# EAGLE design Sensor_LinearCCD_Socket (EAGLE 9.2.1)
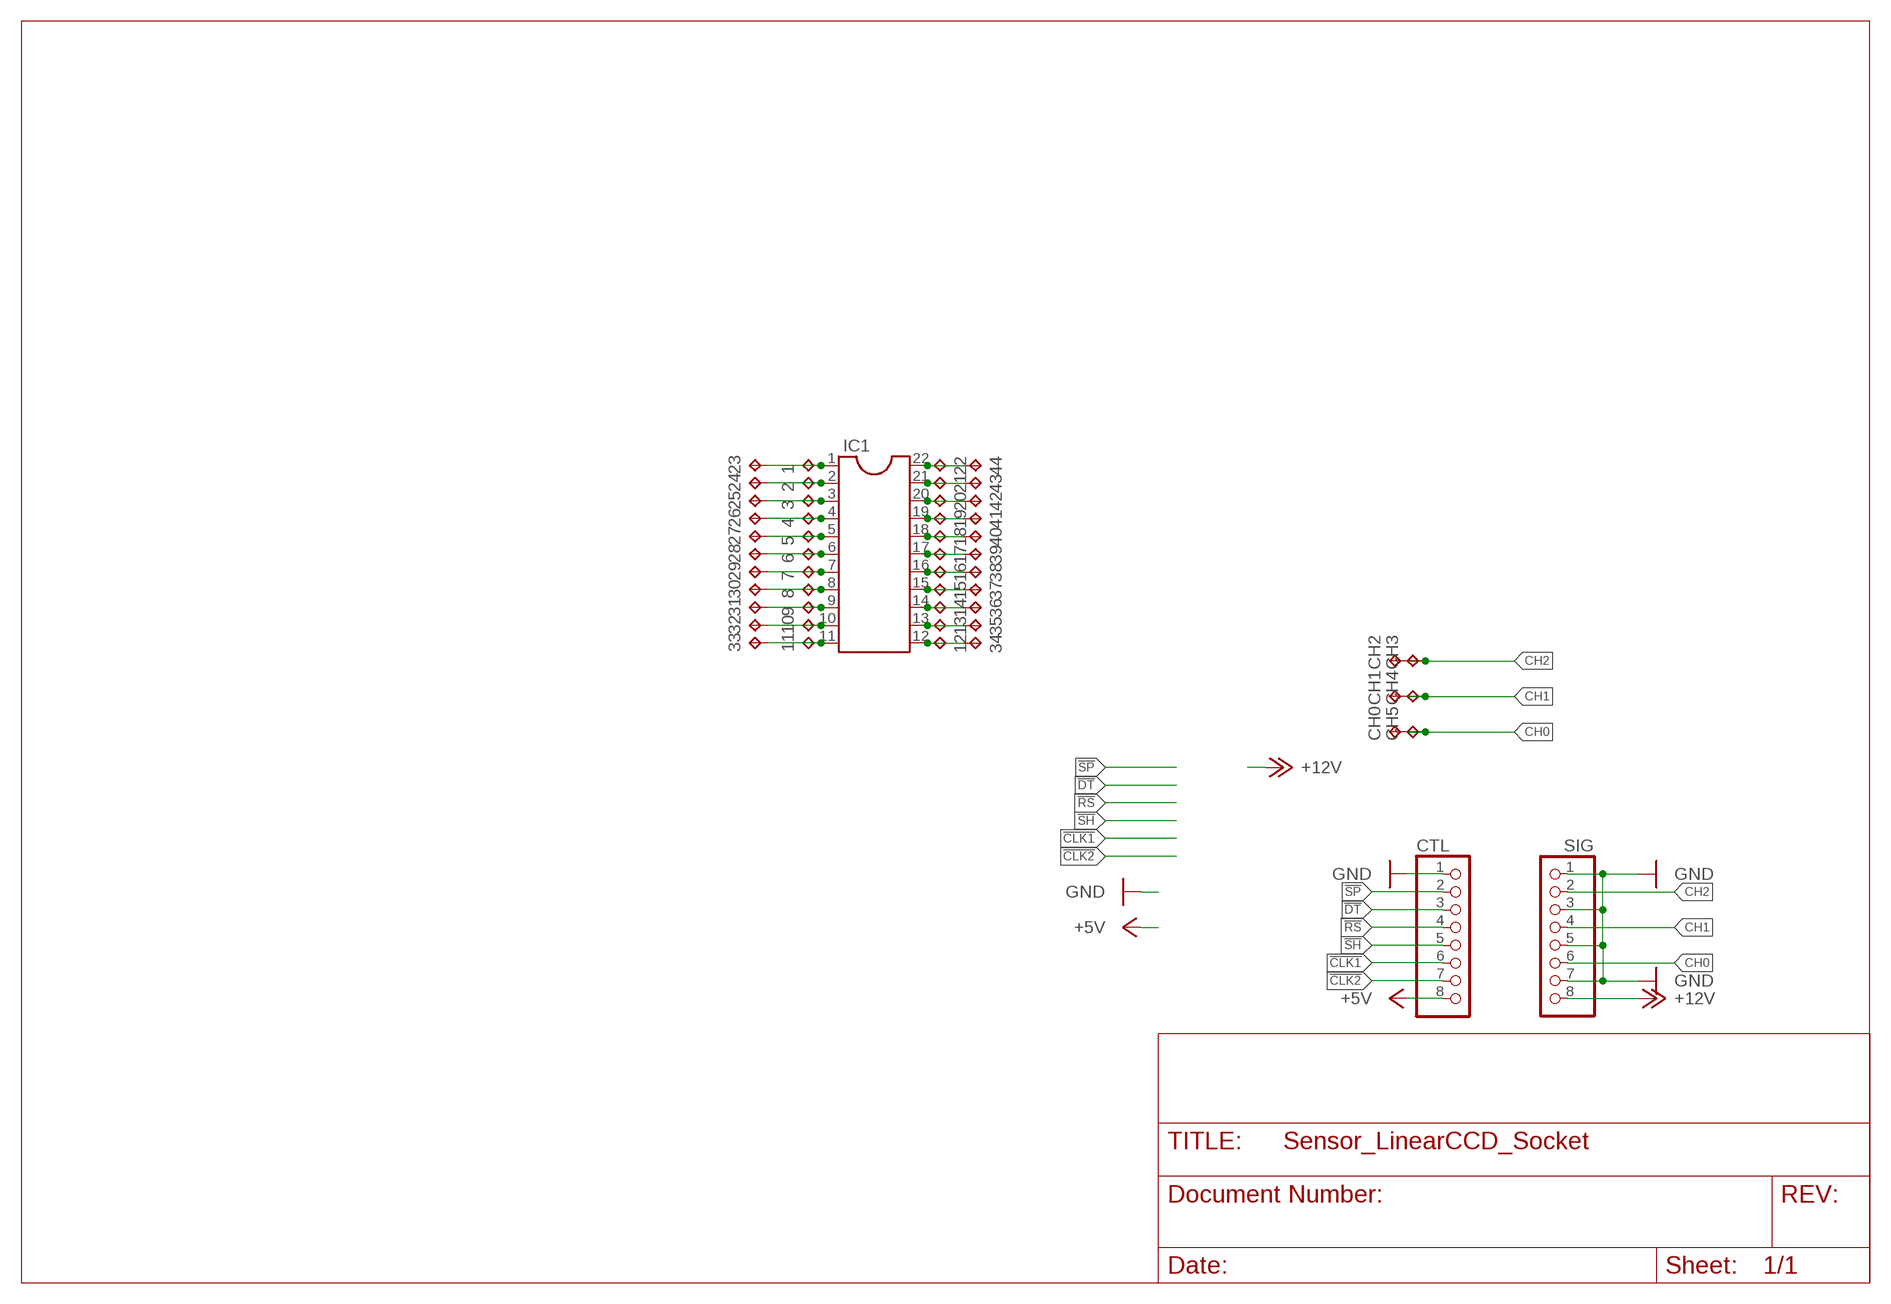
[diagram p0: schematic, sheet 1]

## Parts
1  TPTP15SQ  [TP15SQ]
2  TPTP15SQ  [TP15SQ]
3  TPTP15SQ  [TP15SQ]
4  TPTP15SQ  [TP15SQ]
5  TPTP15SQ  [TP15SQ]
6  TPTP15SQ  [TP15SQ]
7  TPTP15SQ  [TP15SQ]
8  TPTP15SQ  [TP15SQ]
9  TPTP15SQ  [TP15SQ]
10  TPTP15SQ  [TP15SQ]
11  TPTP15SQ  [TP15SQ]
12  TPTP15SQ  [TP15SQ]
13  TPTP15SQ  [TP15SQ]
14  TPTP15SQ  [TP15SQ]
15  TPTP15SQ  [TP15SQ]
16  TPTP15SQ  [TP15SQ]
17  TPTP15SQ  [TP15SQ]
18  TPTP15SQ  [TP15SQ]
19  TPTP15SQ  [TP15SQ]
20  TPTP15SQ  [TP15SQ]
21  TPTP15SQ  [TP15SQ]
22  TPTP15SQ  [TP15SQ]
23  TPTP15SQ  [TP15SQ]
24  TPTP15SQ  [TP15SQ]
25  TPTP15SQ  [TP15SQ]
26  TPTP15SQ  [TP15SQ]
27  TPTP15SQ  [TP15SQ]
28  TPTP15SQ  [TP15SQ]
29  TPTP15SQ  [TP15SQ]
30  TPTP15SQ  [TP15SQ]
31  TPTP15SQ  [TP15SQ]
32  TPTP15SQ  [TP15SQ]
33  TPTP15SQ  [TP15SQ]
34  TPTP15SQ  [TP15SQ]
35  TPTP15SQ  [TP15SQ]
36  TPTP15SQ  [TP15SQ]
37  TPTP15SQ  [TP15SQ]
38  TPTP15SQ  [TP15SQ]
39  TPTP15SQ  [TP15SQ]
40  TPTP15SQ  [TP15SQ]
41  TPTP15SQ  [TP15SQ]
42  TPTP15SQ  [TP15SQ]
43  TPTP15SQ  [TP15SQ]
44  TPTP15SQ  [TP15SQ]
CH0  TPTP15SQ  [TP15SQ]
CH1  TPTP15SQ  [TP15SQ]
CH2  TPTP15SQ  [TP15SQ]
CH3  TPTP15SQ  [TP15SQ]
CH4  TPTP15SQ  [TP15SQ]
CH5  TPTP15SQ  [TP15SQ]
CTL  PINHD-1X8_2.00  [1X08M]
IC1  DIL22-4  [DIL22-4]
SIG  PINHD-1X8_2.00  [1X08M]

## Nets
!CLK1!: CTL.6
!CLK2!: CTL.7
!DT!: CTL.3
!RS!: CTL.4
!SH!: CTL.5
!SP!: CTL.2
+5V: CTL.8
+12V: SIG.8
CH0: CH0.TP CH5.TP SIG.6
CH1: CH1.TP CH4.TP SIG.4
CH2: CH2.TP CH3.TP SIG.2
GND: CTL.1 SIG.1 SIG.3 SIG.5 SIG.7
N$1: 1.TP 23.TP IC1.1
N$2: 2.TP 24.TP IC1.2
N$3: 3.TP 25.TP IC1.3
N$4: 4.TP 26.TP IC1.4
N$5: 5.TP 27.TP IC1.5
N$6: 6.TP 28.TP IC1.6
N$7: 7.TP 29.TP IC1.7
N$8: 8.TP 30.TP IC1.8
N$9: 9.TP 31.TP IC1.9
N$10: 10.TP 32.TP IC1.10
N$11: 11.TP 33.TP IC1.11
N$12: 12.TP 34.TP IC1.12
N$13: 13.TP 35.TP IC1.13
N$14: 14.TP 36.TP IC1.14
N$15: 15.TP 37.TP IC1.15
N$16: 16.TP 38.TP IC1.16
N$17: 17.TP 39.TP IC1.17
N$18: 18.TP 40.TP IC1.18
N$19: 19.TP 41.TP IC1.19
N$20: 20.TP 42.TP IC1.20
N$21: 21.TP 43.TP IC1.21
N$22: 22.TP 44.TP IC1.22

## Library data of the parts
1-44 CH0 CH1-CH5 = testpad:TP: Test pad
CTL SIG = pinhead-1:PINHD-1X8: PIN HEADER
IC1 = ic-package:DIL22: Dual In Line / Socket

## Board
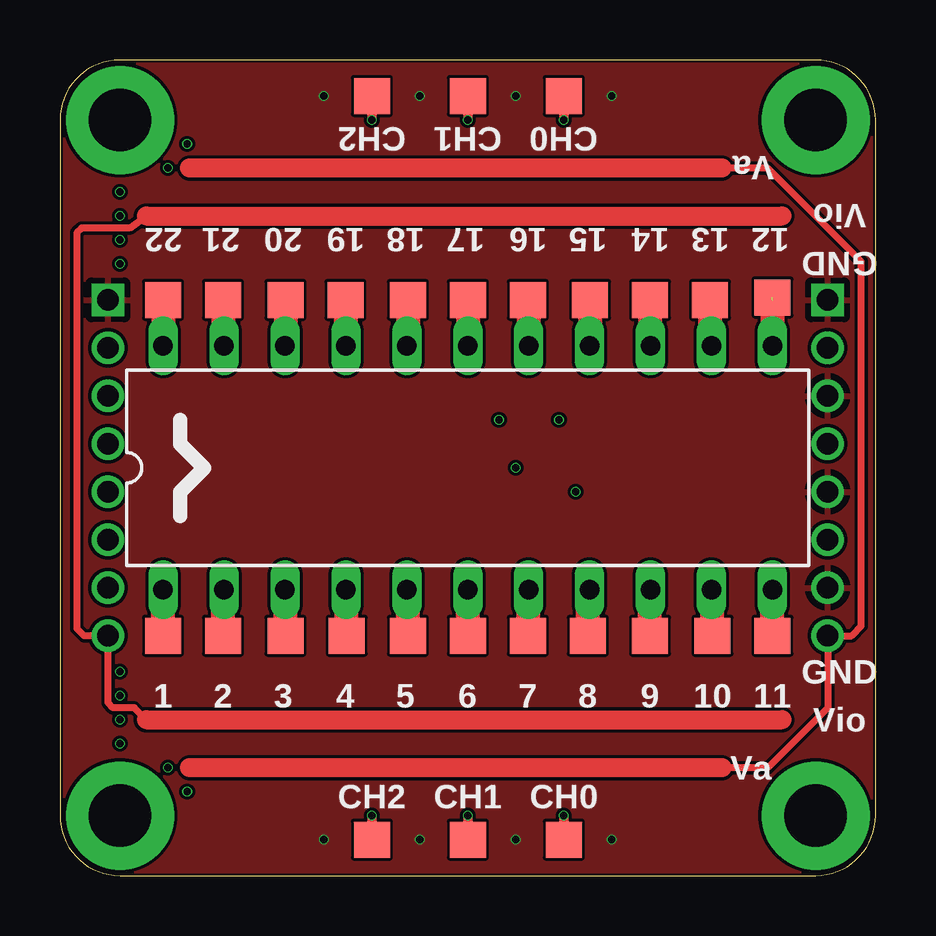
[diagram p1: board, top side]
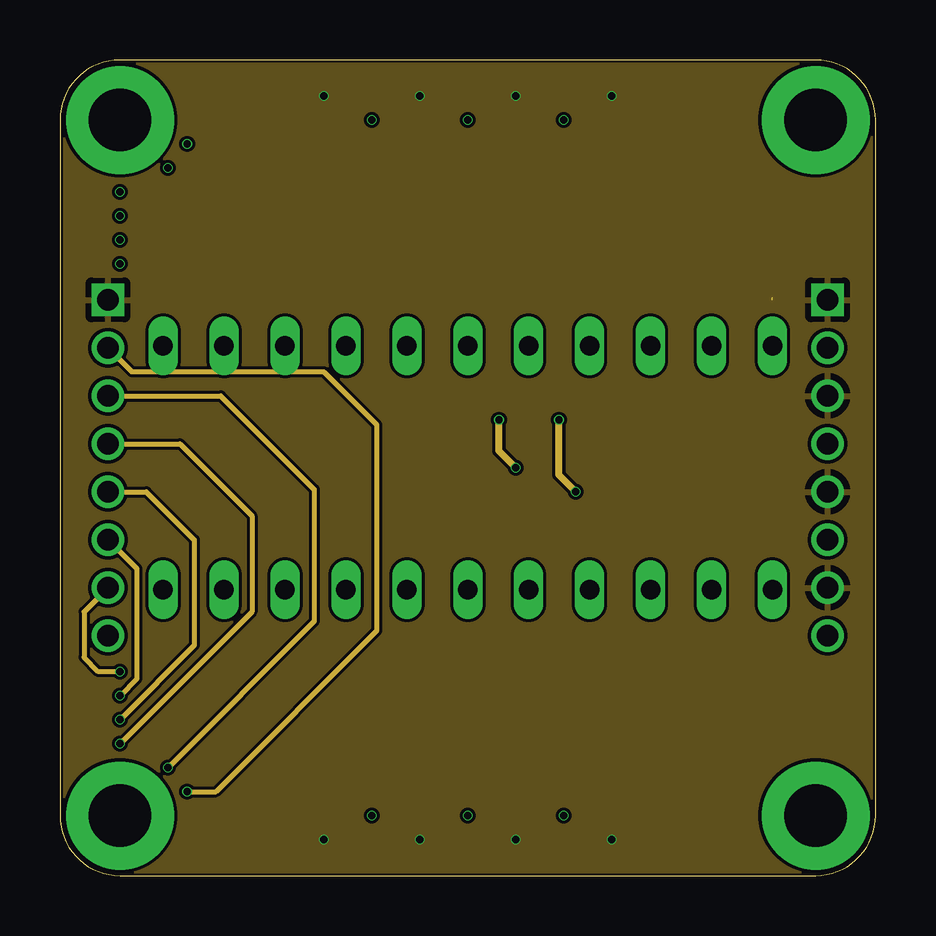
[diagram p2: board, inner layer Route2]
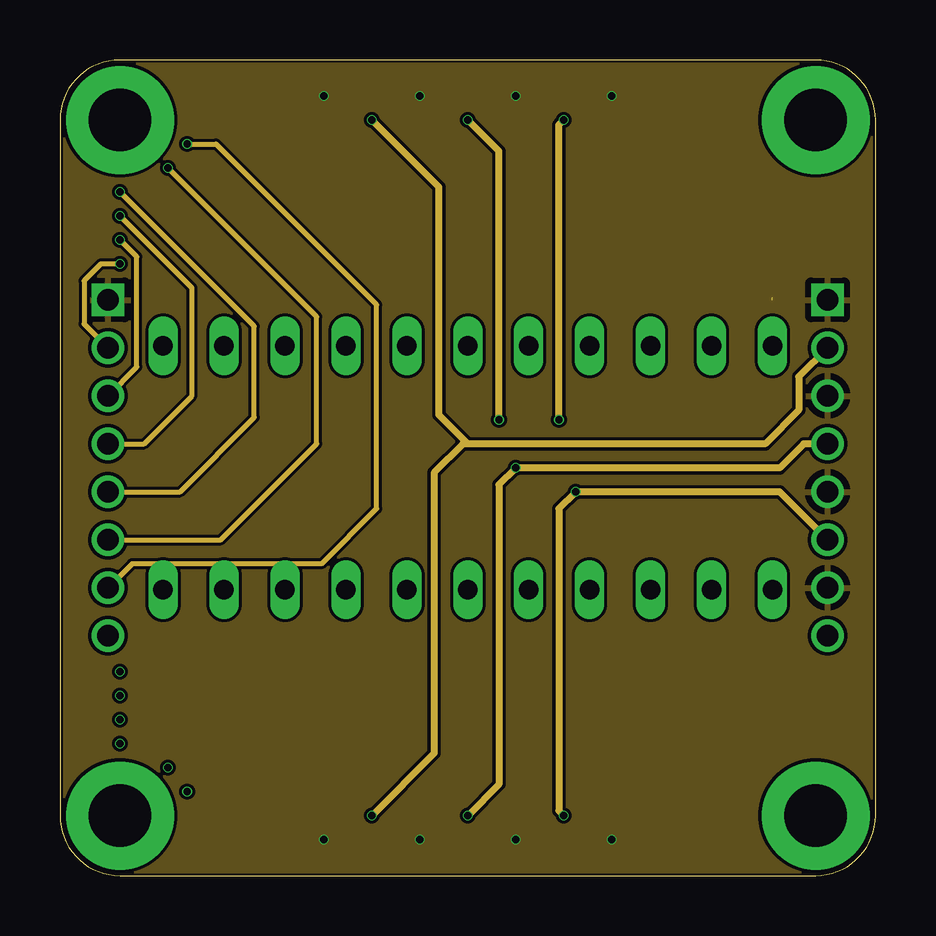
[diagram p3: board, inner layer Route15]
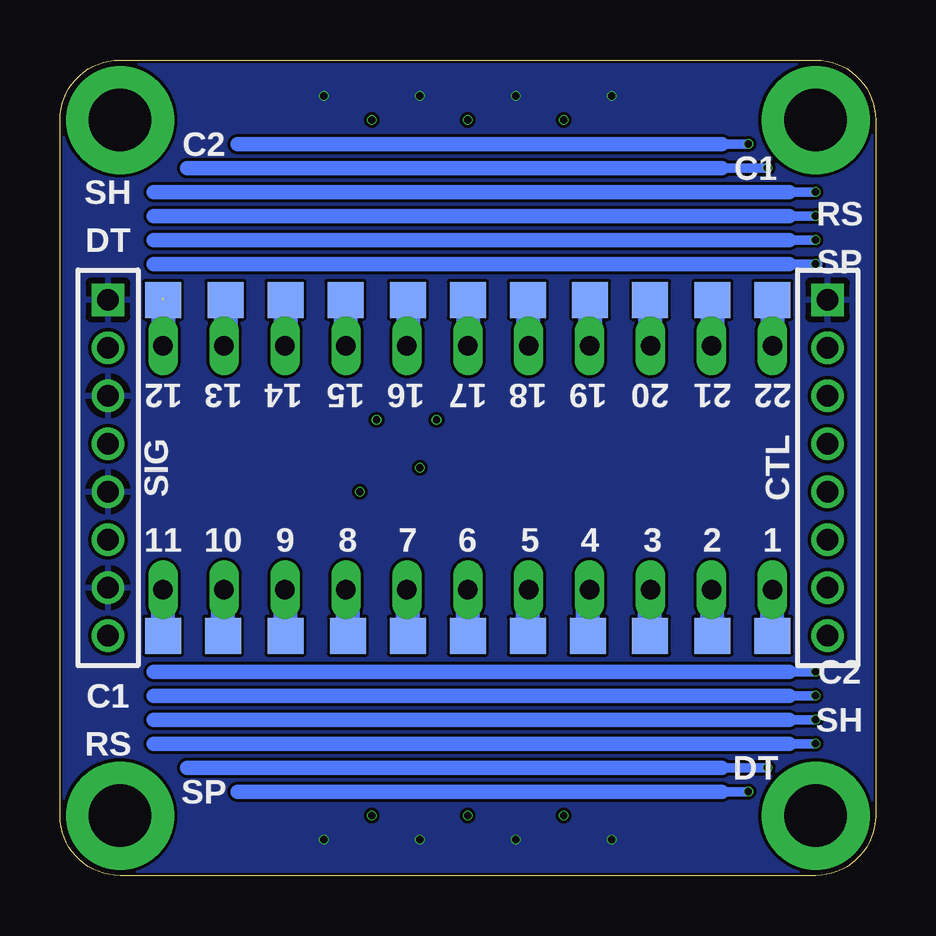
[diagram p4: board, bottom side, seen from below]

Size 34 x 34 mm. Coordinates in mm from the lower left corner, seen from the top.
Outline: 0,31.5 0,2.5 arc90 2.5,0 31.5,0 arc90 34,2.5 34,31.5 arc90 31.5,34 2.5,34 arc90 0,31.5
Copper layers (1*2*15*16): Top 0.035559375mm / dielectric 0.17018125mm / Route2 0.01778125mm / dielectric 47mil / Route15 0.01778125mm / dielectric 0.17018125mm / Bottom 0.035559375mm
Design rules "jlcpcb-4-layer *": minimum track width 5mil, minimum drill 0.2mm, track to track 5mil, track to pad 5mil, pad to pad 5mil, via to via 5mil, smd to smd 0mil, copper to edge 0.1mm, drill to drill 5mil, minimum pad ring 0.1mm, minimum via ring 0.05mm, stop-mask expansion 3mil, vias tented up to drill 100mil, thermal gap 10mil

### Footprints (pad centres in the part's own frame; a part is rotated, then mirrored left to right if it is on the bottom)
TP15SQ = smd 1.5 x 1.5: TP 0,0
1X08M = drill 0.914 square: 1 -7,0 | drill 0.914: 2 -5,0; 3 -3,0; 4 -1,0; 5 1,0; 6 3,0; 7 5,0; 8 7,0
DIL22-4 = drill 0.813 long: 1 -12.7,-5.08; 2 -10.16,-5.08; 3 -7.62,-5.08; 4 -5.08,-5.08; 5 -2.54,-5.08; 6 0,-5.08; 7 2.54,-5.08; 8 5.08,-5.08; 9 7.62,-5.08; 10 10.16,-5.08; 11 12.7,-5.08; 12 12.7,5.08; 13 10.16,5.08; 14 7.62,5.08; 15 5.08,5.08; 16 2.54,5.08; 17 0,5.08; 18 -2.54,5.08; 19 -5.08,5.08; 20 -7.62,5.08; 21 -10.16,5.08; 22 -12.7,5.08

### Placement (x,y rotation side)
1  4.3,10 0 top
2  6.8,10 90 top
3  9.4,10 90 top
4  11.95,10 90 top
5  14.5,10 90 top
6  17,10 90 top
7  19.5,10 90 top
8  22,10 90 top
9  24.6,10 90 top
10  27.2,10 90 top
11  29.7,10 90 top
12  29.7,24.1 90 top
13  27.1,24 270 top
14  24.6,24 270 top
15  22.1,24 270 top
16  19.5,24 270 top
17  17,24 270 top
18  14.5,24 270 top
19  11.9,24 270 top
20  9.4,24 270 top
21  6.8,24 270 top
22  4.3,24 270 top
23  4.3,10 270 bottom
24  6.8,10 270 bottom
25  9.4,10 270 bottom
26  12,10 270 bottom
27  14.5,10 270 bottom
28  17,10 270 bottom
29  19.5,10 270 bottom
30  22,10 270 bottom
31  24.6,10 270 bottom
32  27.2,10 270 bottom
33  29.7,10 270 bottom
34  29.7,24 90 bottom
35  27.1,24 90 bottom
36  24.6,24 90 bottom
37  22.1,24 90 bottom
38  19.5,24 90 bottom
39  17,24 90 bottom
40  14.5,24 90 bottom
41  11.9,24 90 bottom
42  9.4,24 90 bottom
43  6.8,24 90 bottom
44  4.3,24 90 bottom
CH0  21,32.5 90 top
CH1  17,32.5 90 top
CH2  13,32.5 90 top
CH3  13,1.5 90 top
CH4  17,1.5 90 top
CH5  21,1.5 90 top
CTL  2,17 270 bottom
IC1  17,17 0 top
SIG  32,17 270 bottom

### Tracks (layer width: path | path; a pad name or v marks a point on that pad's centre or on a via)
!CLK1!  (via drill 0.3)
  Route2 0.2: CTL.6 3.2,12.8 3.2,8.2 v2.5,7.5
  Route15 0.2: v4.5,29.5 10.7,23.3 10.7,18 6.7,14 CTL.6
  Bottom 0.4: 6.4,29.5 v4.5,29.5 | 3.6,7.5 v2.5,7.5
  Bottom 0.6: 28.7,29.5 6.4,29.5 | 30.1,7.5 3.6,7.5
!CLK2!  (via drill 0.3)
  Route2 0.2: CTL.7 1,11 1,9.1 1.6,8.5 v2.5,8.5
  Route15 0.2: CTL.7 3,13 10.9,13 13.2,15.3 13.2,23.8 6.5,30.5 v5.3,30.5
  Bottom 0.4: 6.4,30.5 v5.3,30.5 | 3.6,8.5 v2.5,8.5
  Bottom 0.6: 26.6,30.5 6.4,30.5 | 30.1,8.5 3.6,8.5
!DT!  (via drill 0.3)
  Route2 0.2: CTL.3 6.7,20 10.6,16.1 10.6,10.6 v4.5,4.5
  Route15 0.2: CTL.3 3.2,21.2 3.2,25.8 v2.5,26.5
  Bottom 0.4: 3.6,26.5 v2.5,26.5 | 6.4,4.5 v4.5,4.5
  Bottom 0.6: 30.1,26.5 3.6,26.5 | 28.7,4.5 6.4,4.5
!RS!  (via drill 0.3)
  Route2 0.2: CTL.4 5,18 8,15 8,11 v2.5,5.5
  Route15 0.2: CTL.4 3.5,18 5.5,20 5.5,24.5 v2.5,27.5
  Bottom 0.4: 3.6,27.5 v2.5,27.5 | 3.6,5.5 v2.5,5.5
  Bottom 0.6: 30.1,27.5 3.6,27.5 | 30.1,5.5 3.6,5.5
!SH!  (via drill 0.3)
  Route2 0.2: CTL.5 3.6,16 5.6,14 5.6,9.6 v2.5,6.5
  Route15 0.2: CTL.5 5,16 8.1,19.1 8.1,22.9 v2.5,28.5
  Bottom 0.4: 3.6,28.5 v2.5,28.5 | 3.6,6.5 v2.5,6.5
  Bottom 0.6: 30.1,28.5 3.6,28.5 | 30.1,6.5 3.6,6.5
!SP!  (via drill 0.3)
  Route2 0.2: CTL.2 3,21 11,21 13.2,18.8 13.2,10.2 6.5,3.5 v5.3,3.5
  Route15 0.2: CTL.2 1,23 1,24.8 1.7,25.5 v2.5,25.5
  Bottom 0.4: 3.6,25.5 v2.5,25.5 2.4,25.5 | 6.4,3.5 v5.3,3.5
  Bottom 0.6: 30.1,25.5 3.6,25.5 | 26.6,3.5 6.4,3.5
+5V
  Top 0.3: 3.6,6.5 3.1,7 2.2,7 2,7.2 CTL.8 1,10 0.7,10.3 0.7,26.8 0.9,27 2.9,27 3.6,27.5
  Top 0.8: 3.6,6.5 30.1,6.5 | 3.6,27.5 30.1,27.5
+12V
  Top 0.3: 27.6,4.5 29.5,4.5 32,7 SIG.8 33,10 33.4,10.4 33.4,25.6 29.5,29.5 27.6,29.5
  Top 0.8: 27.6,4.5 5.4,4.5 | 27.6,29.5 5.4,29.5
CH0  (via drill 0.3)
  Top 0.4: CH0.TP v21,31.5 | CH5.TP v21,2.5
  Route2 0.3: v21.5,16 20.8,16.7 v20.8,19
  Route15 0.3: SIG.6 30,16 v21.5,16 20.8,15.3 20.8,2.7 v21,2.5 | v20.8,19 20.8,31.3 v21,31.5
CH1  (via drill 0.3)
  Top 0.4: CH1.TP v17,31.5 | CH4.TP v17,2.5
  Route2 0.3: v19,17 18.3,17.7 v18.3,19
  Route15 0.3: SIG.4 31,18 30,17 v19,17 18.3,16.3 18.3,3.8 v17,2.5 | v17,31.5 18.3,30.2 v18.3,19
CH2  (via drill 0.3)
  Top 0.4: CH2.TP v13,31.5 | CH3.TP v13,2.5
  Route15 0.3: SIG.2 30.8,20.8 30.8,19.4 29.4,18 17,18 | 17,18 16.8,18 15.6,16.8 15.6,5.1 v13,2.5 | 17,18 15.8,19.2 15.8,28.7 v13,31.5
GND  (via drill 0.3)
  other vias: 11,32.5 15,32.5 19,32.5 23,32.5 11,1.5 15,1.5 19,1.5 23,1.5
  pour Top: 0,0 34,0 34,34 0,34
  pour Bottom: 0,0 34,0 34,34 0,34
  pour Route15: 0,0 34,0 34,34 0,34
  pour Route2: 0,0 34,0 34,34 0,34
N$1
  Top 1: 23.TP IC1.1
  Bottom 1: 23.TP IC1.1
N$2
  Top 1: 24.TP 6.8,11.88 IC1.2
  Bottom 1: 24.TP 6.8,11.88 IC1.2
N$3
  Top 1: 25.TP 9.4,11.9 IC1.3
  Bottom 1: 25.TP 9.4,11.9 IC1.3
N$4
  Top 1: 4.TP 11.95,11.89 IC1.4
  Bottom 1: 26.TP 12,11.84 IC1.4
N$5
  Top 1: 27.TP 14.5,11.88 IC1.5
  Bottom 1: 27.TP 14.5,11.88 IC1.5
N$6
  Top 1: 28.TP IC1.6
  Bottom 1: 28.TP IC1.6
N$7
  Top 1: 29.TP 19.54,10.04 IC1.7
  Bottom 1: 29.TP 19.5,11.88 IC1.7
N$8
  Top 1: 30.TP 22,11.84 IC1.8
  Bottom 1: 30.TP 22,11.84 IC1.8
N$9
  Top 1: 31.TP 24.6,11.9 IC1.9
  Bottom 1: 31.TP 24.6,11.9 IC1.9
N$10
  Top 1: 32.TP 27.2,11.88 IC1.10
  Bottom 1: 32.TP 27.2,11.88 IC1.10
N$11
  Top 1: 33.TP IC1.11
  Bottom 1: 33.TP IC1.11
N$12  (1 unrouted)
  Top 1: 12.TP IC1.12
  Bottom 1: 34.TP 29.7,21.98
N$13
  Top 1: 35.TP 27.1,22.14 IC1.13
  Bottom 0.6: 27.4,23.7 35.TP
  Bottom 1: 35.TP 27.1,22.14 IC1.13
N$14
  Top 1: 36.TP 24.6,22.1 IC1.14
  Bottom 1: 36.TP 24.6,22.1 IC1.14
N$15
  Top 1: 37.TP 22.1,22.1 IC1.15
  Bottom 1: 37.TP 22.1,22.1 IC1.15
N$16
  Top 1: 38.TP 19.54,23.96 IC1.16
  Bottom 1: 38.TP 19.5,22.12 IC1.16
N$17
  Top 1: 39.TP IC1.17
  Bottom 1: 39.TP IC1.17
N$18
  Top 1: 40.TP 14.5,22.12 IC1.18
  Bottom 1: 40.TP 14.5,22.12 IC1.18
N$19
  Top 0.6: 12.17,23.73 41.TP
  Top 1: 41.TP 11.9,22.1 IC1.19
  Bottom 0.6: 12.17,23.73 41.TP
  Bottom 1: 41.TP 11.9,22.1 IC1.19
N$20
  Top 1: 42.TP 9.4,22.1 IC1.20
  Bottom 1: 42.TP 9.4,22.1 IC1.20
N$21
  Top 0.6: 7.09,23.71 43.TP
  Top 1: 43.TP 6.8,22.12 IC1.21
  Bottom 0.6: 7.09,23.71 43.TP
  Bottom 1: 43.TP 6.8,22.12 IC1.21
N$22
  Top 1: 44.TP IC1.22
  Bottom 1: 44.TP IC1.22
N$23  (via drill 2.6 pad 4.5)
  other vias: 31.5,31.5
N$24  (via drill 2.6 pad 4.5)
  other vias: 2.5,31.5
N$25  (via drill 2.6 pad 4.5)
  other vias: 2.5,2.5
N$26  (via drill 2.6 pad 4.5)
  other vias: 31.5,2.5

### Text on the board
tNames: Va | 22 | 21 | 20 | 19 | 18 | 17 | 16 | 15 | 14 | 13 | 12 | Vio | GND | GND | 1 | 2 | 3 | 4 | 5 | 6 | 7 | 8 | 9 | 10 | 11 | Vio | Va | CH2 | CH1 | CH0
bNames: C2 | C1 | SH | RS | DT | SP | 22 | 21 | 20 | 19 | 18 | 17 | 16 | 15 | 14 | 13 | 12 | 1 | 2 | 3 | 4 | 5 | 6 | 7 | 8 | 9 | 10 | 11 | C2 | SH | C1 | DT | RS | SP